# EAGLE design PiBoard (EAGLE 6.5.0)
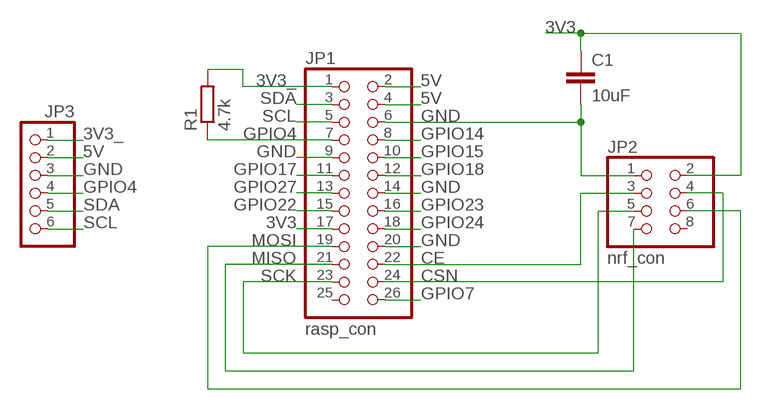
[diagram p0: schematic, sheet 1]

## Parts
C1  10uF  CAP1206  [1206]
JP1  rasp_con  PINHD-2X13  [2X13]
JP2  nrf_con  PINHD-2X4  [2X04]
JP3  PINHD-1X6  [1X06]
R1  4.7k  R-EU_R1206  [R1206]

## Nets
3V3: C1.1 JP1.17 JP2.2
3V3_: JP1.1 JP3.1 R1.2
5V: JP1.2 JP1.4 JP3.2
CE: JP1.22 JP2.3
CSN: JP1.24 JP2.4
GND: C1.2 JP1.6 JP1.9 JP1.14 JP1.20 JP2.1 JP3.3
GPIO4: JP1.7 JP3.4 R1.1
GPIO7: JP1.26
GPIO14: JP1.8
GPIO15: JP1.10
GPIO17: JP1.11
GPIO18: JP1.12
GPIO22: JP1.15
GPIO23: JP1.16
GPIO24: JP1.18
GPIO27: JP1.13
MISO: JP1.21 JP2.7
MOSI: JP1.19 JP2.6
SCK: JP1.23 JP2.5
SCL: JP1.5 JP3.6
SDA: JP1.3 JP3.5
Unconnected: JP1.25 JP2.8

## Library data of the parts
C1 = SparkFun-Capacitors:CAP: Capacitor Standard 0603 ceramic capacitor, and 0.1" leaded capacitor.
JP1 = pinhead:PINHD-2X13: PIN HEADER
JP2 = pinhead:PINHD-2X4: PIN HEADER
JP3 = pinhead:PINHD-1X6: PIN HEADER
R1 = resistor:R-EU_: RESISTOR, European symbol

## Board
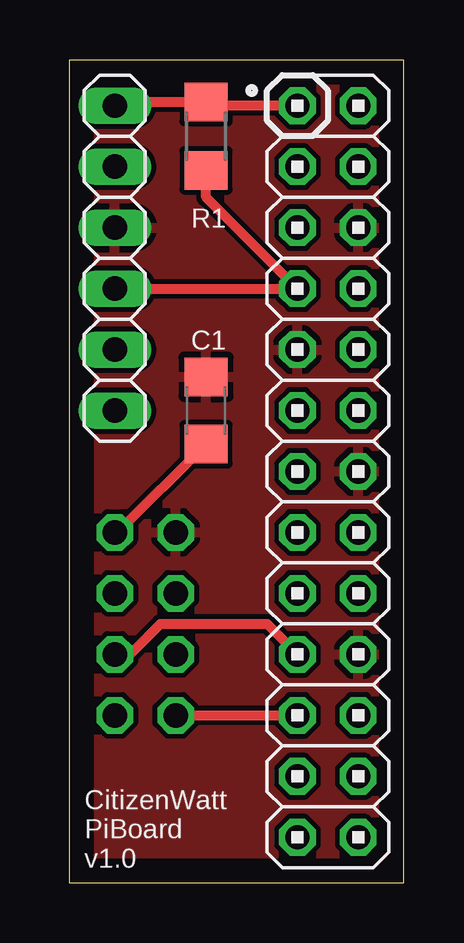
[diagram p1: board, top side]
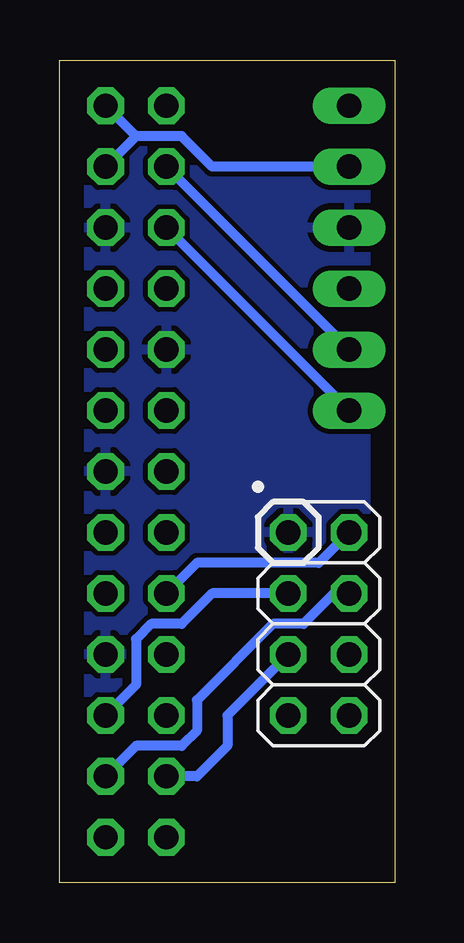
[diagram p2: board, bottom side, seen from below]

Size 13.97 x 34.29 mm. Coordinates in mm from the lower left corner, seen from the top.
Outline: 0,34.29 0,0 13.97,0 13.97,34.29 0,34.29
Copper layers (1*16): Top 0.035mm / dielectric 1.5mm / Bottom 0.035mm
Design rules "default": minimum track width 10mil, minimum drill 24mil, track to track 8mil, track to pad 8mil, pad to pad 8mil, via to via 8mil, smd to smd 8mil, copper to edge 40mil, drill to drill 8mil, minimum pad ring 10mil, minimum via ring 8mil, stop-mask expansion 4mil, vias tented up to drill 0mil, thermal gap 10mil

### Footprints (pad centres in the part's own frame; a part is rotated, then mirrored left to right if it is on the bottom)
1206 = smd 1.6 x 1.8: 1 -1.4,0; 2 1.4,0
2X13 = drill 1.016 octagon: 1 -15.24,-1.27; 2 -15.24,1.27; 3 -12.7,-1.27; 4 -12.7,1.27; 5 -10.16,-1.27; 6 -10.16,1.27; 7 -7.62,-1.27; 8 -7.62,1.27; 9 -5.08,-1.27; 10 -5.08,1.27; 11 -2.54,-1.27; 12 -2.54,1.27; 13 0,-1.27; 14 0,1.27; 15 2.54,-1.27; 16 2.54,1.27; 17 5.08,-1.27; 18 5.08,1.27; 19 7.62,-1.27; 20 7.62,1.27; 21 10.16,-1.27; 22 10.16,1.27; 23 12.7,-1.27; 24 12.7,1.27; 25 15.24,-1.27; 26 15.24,1.27
2X04 = drill 1.016 octagon: 1 -3.81,-1.27; 2 -3.81,1.27; 3 -1.27,-1.27; 4 -1.27,1.27; 5 1.27,-1.27; 6 1.27,1.27; 7 3.81,-1.27; 8 3.81,1.27
1X06 = drill 1.016 long: 1 -6.35,0; 2 -3.81,0; 3 -1.27,0; 4 1.27,0; 5 3.81,0; 6 6.35,0
R1206 = smd 1.6 x 1.803: 1 -1.422,0; 2 1.422,0

### Placement (x,y rotation side)
C1  5.71,19.68 90 top
JP1  10.79,17.14 270 top
JP2  3.17,10.79 270 bottom
JP3  1.91,26.04 270 top
R1  5.71,31.11 90 top

### Tracks (layer width: path | path; a pad name or v marks a point on that pad's centre or on a via)
3V3
  Top 0.406: JP2.2 2.04,14.61 C1.1
  Bottom 0.406: JP2.2 3.17,13.34 8.26,13.34 JP1.17
3V3_
  Top 0.406: JP1.1 5.87,32.38 R1.2 1.91,32.54 JP3.1
5V
  Bottom 0.406: JP3.2 7.62,29.84 8.89,31.11 10.79,31.11 | 10.79,31.11 JP1.2 | JP1.4 10.79,31.11
CE
  Bottom 0.406: JP2.3 7.62,12.06 8.89,10.79 10.16,10.79 10.79,10.16 10.79,8.26 JP1.22
CSN
  Bottom 0.406: JP2.4 2.54,12.06 3.81,10.79 5.08,10.79 8.26,7.62 8.26,6.35 8.89,5.71 10.79,5.71 JP1.24
GND
  pour Bottom: 0,0 0,34.29 13.97,34.29 13.97,0
  pour Top: 0,0 0,34.29 13.97,34.29 13.97,0
GPIO4
  Top 0.406: R1.1 5.71,28.57 JP1.7 JP3.4
MISO
  Top 0.406: JP2.7 JP1.21
MOSI
  Top 0.406: JP2.6 2.54,9.53 3.81,10.79 8.26,10.79 JP1.19
SCK
  Bottom 0.406: JP2.5 6.99,6.99 6.99,5.71 8.26,4.45 JP1.23
SCL
  Bottom 0.406: JP3.6 JP1.5
SDA
  Bottom 0.406: JP3.5 JP1.3

### Text on the board
tPlace: R1 | C1 | CitizenWatt / PiBoard / v1.0